# Altium schematic sheet power1.SchDoc
size A; SheetNumber: 3; SheetTotal: 8
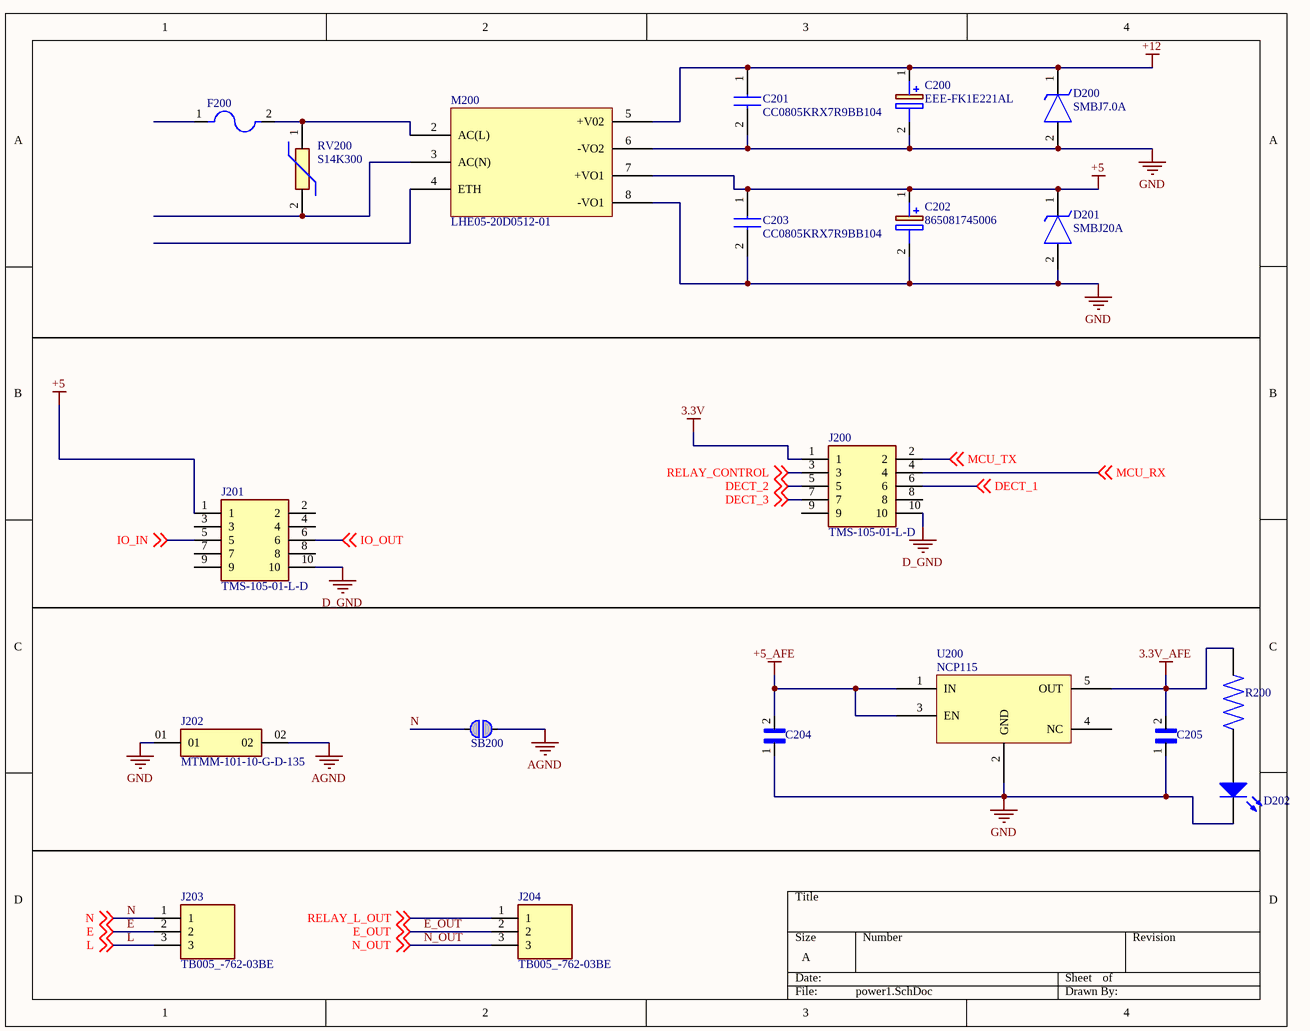
[diagram p0: power1.SchDoc]

## Parts
C200  EEE-FK1E221AL  [EEETC1V470P]
C201  CC0805KRX7R9BB104  [CAPC2012X70N]
C202  865081745006  [EEETC1V470P]
C203  CC0805KRX7R9BB104  [CAPC2012X70N]
C204  06033G104ZAT4A  [CAPC1608X90N]  (value not drawn)
C205  06033G104ZAT4A  [CAPC1608X90N]  (value not drawn)
D200  SMBJ7.0A  [DIOM5436X261N]
D201  SMBJ20A  [DIOM5436X261N]
D202  LED-BLUE  [LED-0603-BLUE]  (value not drawn)
F200  MRT-500-AMMO  [FUSE_MRT-500-AMMO]  (value not drawn)
J200  TMS-105-01-L-D  [HDRV10W51P254X127_2X5_635X498X838P - duplicate]
J201  TMS-105-01-L-D  [HDRV10W51P254X127_2X5_635X498X838P - duplicate]
J202  MTMM-101-10-G-D-135  [SAMTEC_MTMM-101-10-G-D-135]
J203  TB005_-762-03BE  [CUI_TB005 -762-03BE]
J204  TB005_-762-03BE  [CUI_TB005 -762-03BE]
M200  LHE05-20D0512-01  [LHE05-20Dxx]
R200  SR0603KR-7W270RL  [RESC1608X55 - duplicate]  (value not drawn)
RV200  S14K300  [S14K300]
SB200  Solderbridge  [SOLDERBRIDGE_OPEN]  (value not drawn)  (no BOM)
U200  NCP115ASN330T2G  [NCP115 - duplicate]  (value not drawn)

## Nets
3.3V: J200.1
3.3V_AFE: C205.2 R200.2 U200.5(OUT)
+5: C202.1(+) C203.1 D201.1(K) J201.1 M200.7(+VO1)
+5_AFE: C204.2 U200.1(IN) U200.3(EN)
+12: C200.1(+) C201.1 D200.1(K) M200.5(+V02)
AGND: J202.02 SB200.1
D_GND: J200.10 J201.10
GND: C200.2(-) C201.2 C202.2(-) C203.2 C204.1 C205.1 D200.2(A) D201.2(A) D202.2(K) J202.01 M200.6(-VO2) M200.8(-VO1) U200.2(GND)
DECT_1: J200.6 ; off-sheet DECT_1
DECT_2: J200.5 ; off-sheet DECT_2
DECT_3: J200.7 ; off-sheet DECT_3
E: J203.2 ; off-sheet E
E_OUT: J204.2 ; off-sheet E_OUT
IO_IN: J201.5 ; off-sheet IO_IN
IO_OUT: J201.6 ; off-sheet IO_OUT
L: J203.3 ; off-sheet L
MCU_RX: J200.4 ; off-sheet MCU_RX
MCU_TX: J200.2 ; off-sheet MCU_TX
N: J203.1 SB200.2 ; off-sheet N
N_OUT: J204.3 ; off-sheet N_OUT
RELAY_CONTROL: J200.3 ; off-sheet RELAY_CONTROL
RELAY_L_OUT: J204.1 ; off-sheet RELAY_L_OUT
NetD202_1: D202.1(A) R200.1
NetF200_2: F200.2 M200.2(AC(L)) RV200.1
NetM200_3: M200.3(AC(N)) RV200.2

Not connected (* = marked no-connect by the designer): F200 1; J200 8 9; J201 2 3 4 7 8 9; M200 4(ETH); U200 4(NC)

## Notes on the sheet
- (in symbol NCP115ASN330T2G) NCP115

## Library data of the parts
C200 = EEE-FK1E221AL: Capacitor Polarised; Manufacturer_Name: Panasonic; Datasheet Link: http://industrial.panasonic.com/cdbs/www-data/pdf/RDE0000/RDE0000C1278.pdf; Manufacturer_Part_Number: EEE-FK1E221AL; Mouser Part Number: 667-EEE-FK1E221AL; Mouser Price/Stock: https://www.mouser.co.uk/ProductDetail/Panasonic/EEE-FK1E221AL?qs=vmHwEFxEFR8%2FJK%252Brqcoc9A%3D%3D
C201 C203 = CC0805KRX7R9BB104: Capacitor; Manufacturer_Name: TDK; Datasheet Link: https://www.yageo.com/upload/media/product/productsearch/datasheet/mlcc/UPY-GPHC_X7R_6.3V-to-50V_20.pdf; Height: 0.7mm; Manufacturer_Part_Number: CC0805KRX7R9BB104
C202 = 865081745006: Capacitor Polarised; Manufacturer_Name: Wurth Elektronik; Datasheet Link: https://www.we-online.com/components/products/datasheet/865081745006.pdf; Height: 7.7mm; Manufacturer_Part_Number: 865081745006; Mouser Part Number: 710-865081745006; Mouser Price/Stock: https://www.mouser.co.uk/ProductDetail/Wurth-Elektronik/865081745006?qs=amGC7iS6iy86HOLWKe8vSw%3D%3D
C204 C205 = 06033G104ZAT4A: Cap Ceramic 0.1uF 25V Y5V -20% to 80% SMD 0603 85C T/R; MF: {'manufacturer': u'AVX'}; Availability: Unavailable; MP: 06033G104ZAT4A; Price: None; Package: None; Value: *
D200 = SMBJ7.0A: TVS Diode (Uni-directional); Manufacturer_Name: LITTELFUSE; Datasheet Link: https://componentsearchengine.com/Datasheets/2/SMBJ7.0A.pdf; Height: 2.61mm; Manufacturer_Part_Number: SMBJ7.0A; Mouser Part Number: 576-SMBJ7.0A; Mouser Price/Stock: https://www.mouser.co.uk/ProductDetail/Littelfuse/SMBJ7.0A?qs=JJML70Qc14tN8I1Byy%252B8EA%3D%3D; Arrow Part Number: SMBJ7.0A; Arrow Price/Stock: https://www.arrow.com/en/products/smbj7.0a/littelfuse?region=nac
D201 = SMBJ20A: TVS Diode (Uni-directional); Manufacturer_Name: Bourns; Datasheet Link: https://www.bourns.com/docs/product-datasheets/smbj.pdf?sfvrsn=34552159_17; Height: 2.44mm; Manufacturer_Part_Number: SMBJ20A; Mouser Part Number: 652-SMBJ20A; Mouser Price/Stock: https://www.mouser.co.uk/ProductDetail/Bourns/SMBJ20A?qs=%252Bf8Cd6aE5bx0luBLnSoXTg%3D%3D; Arrow Part Number: SMBJ20A; Arrow Price/Stock: https://www.arrow.com/en/products/smbj20a/bourns?region=nac
D202 = LTST-C193TBKT-5A: Blue 470nm LED Indication - Discrete 2.8V 0603 (1608 Metric); Manufacturer: Lite-On; Part Number: LTST-C193TBKT-5A; Value: LED-BLUE; Supplier 1: Digi-Key; Supplier Part Number 1: 160-1827-1-ND
F200 = MRT-500-AMMO: MRF 1-BULK (0691-1000-01) | 2-Pin Radial Fuse | Round | Fast Acting | IEC | Bulk Pack | 1A; MF: {'manufacturer': u'Bel Fuse'}; Availability: Unavailable; Price: None; Package: None; MP: MRT-500-AMMO; Value: *
J200 J201 = TMS-105-01-L-D: Connector; Manufacturer_Name: SAMTEC; Datasheet Link: http://suddendocs.samtec.com/catalog_english/tms_th.pdf; Height: 8.38mm; Manufacturer_Part_Number: TMS-105-01-L-D; Mouser Part Number: 200-TMS10501LD; Mouser Price/Stock: https://www.mouser.com/Search/Refine.aspx?Keyword=200-TMS10501LD; Arrow Part Number: TMS-105-01-L-D; Arrow Price/Stock: https://www.arrow.com/en/products/tms-105-01-l-d/samtec
J202 = MTMM-101-10-G-D-135: MF: {'manufacturer': u'Samtec'}; Package: None; Price: None; Value: *; MP: MTMM-101-10-G-D-135; Availability: Unavailable
J203 J204 = TB005_-762-03BE: MF: {'manufacturer': u'CUI'}; MP: TB005 -762-03BE; Availability: Unavailable; Price: None; Package: None; Value: *
M200 = LHE05-20D0512-01: LHE05-20Dxx series is one of Mornsun’s compact size multiple output power converters
R200 = SR0603KR-7W270RL: MF: {'manufacturer': u'Yageo'}; Package: None; Price: None; Value: *; MP: SR0603KR-7W270RL; Availability: Unavailable
RV200 = S14K300: Varistor; Manufacturer_Name: TDK; Datasheet Link: https://www.tdk-electronics.tdk.com/inf/70/db/var/SIOV_Leaded_StandarD.pdf; Height: 18.5mm; Manufacturer_Part_Number: S14K300
SB200 = SOLDERBRIDGE_OPEN_1: Open Solderbridge; Artikkelnr Noca: N.A.; Part Number: Solderbridge; Manufacturer: *; Manufacturer Part Number: *; Datasheet: *; LatestRevisionDate: 2009-12-14; Pin Count: 2; Publisher: Nordic Semiconductor; Published: 2009-12-14; Value: Solderbridge; Note: *; Supplier: *; Supplier part number: *; 2nd source Supplier: *; 2nd source part number: *; Footprint Doc: Solderbridge; Artikkelnr Simpro: N.A.